# EAGLE design PALVersion (EAGLE 6.6.0)
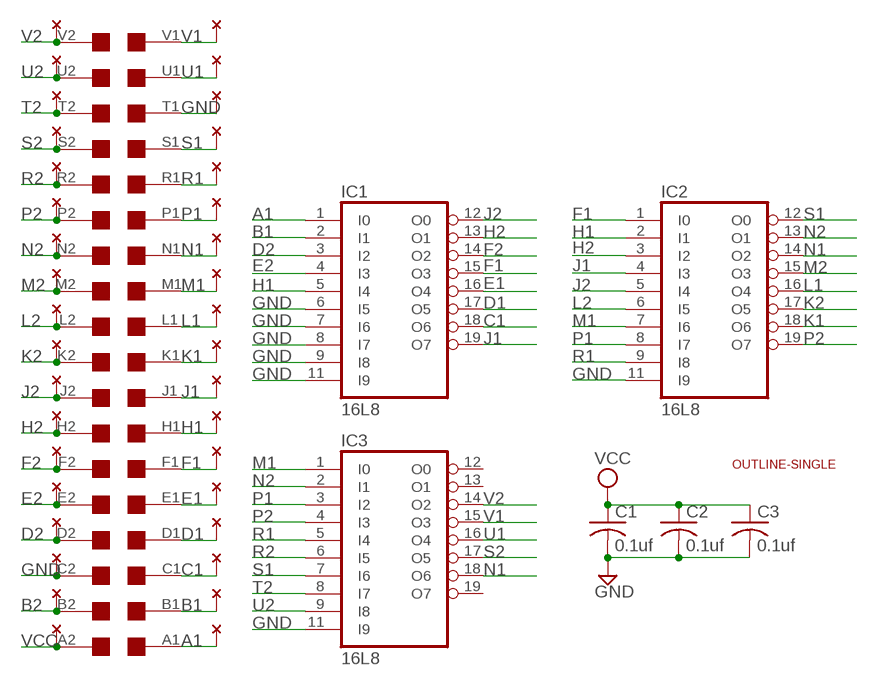
[diagram p0: schematic, sheet 1]

## Parts
C1  0.1uf  C-US050-025X075  [C050-025X075]
C2  0.1uf  C-US050-025X075  [C050-025X075]
C3  0.1uf  C-US050-025X075  [C050-025X075]
IC1  16L8  [DIL20]
IC2  16L8  [DIL20]
IC3  16L8  [DIL20]
U$1  EDGE-2CONNECTOR  [EDGE-CON2]
U$4  THRU-HOLE2A  [THRU-HOLEA]
U$5  OUTLINE-SINGLE  [SINGLE]

## Nets
A1: IC1.1(I0) U$1.A1 U$4.A1
B1: IC1.2(I1) U$1.B1 U$4.B1
B2: U$1.B2 U$4.B2
C1: IC1.18(O6) U$1.C1 U$4.C1
D1: IC1.17(O5) U$1.D1 U$4.D1
D2: IC1.3(I2) U$1.D2 U$4.D2
E1: IC1.16(O4) U$1.E1 U$4.E1
E2: IC1.4(I3) U$1.E2 U$4.E2
F1: IC1.15(O3) IC2.1(I0) U$1.F1 U$4.F1
F2: IC1.14(O2) U$1.F2 U$4.F2
GND: C1.2 C2.2 C3.2 IC1.6(I5) IC1.7(I6) IC1.8(I7) IC1.9(I8) IC1.11(I9) IC2.11(I9) IC3.11(I9) U$1.C2 U$1.T1 U$4.C2 U$4.T1
H1: IC1.5(I4) IC2.2(I1) U$1.H1 U$4.H1
H2: IC1.13(O1) IC2.3(I2) U$1.H2 U$4.H2
J1: IC1.19(O7) IC2.4(I3) U$1.J1 U$4.J1
J2: IC1.12(O0) IC2.5(I4) U$1.J2 U$4.J2
K1: IC2.18(O6) U$1.K1 U$4.K1
K2: IC2.17(O5) U$1.K2 U$4.K2
L1: IC2.16(O4) U$1.L1 U$4.L1
L2: IC2.6(I5) U$1.L2 U$4.L2
M1: IC2.7(I6) IC3.1(I0) U$1.M1 U$4.M1
M2: IC2.15(O3) U$1.M2 U$4.M2
N1: IC2.14(O2) IC3.18(O6) U$1.N1 U$4.N1
N2: IC2.13(O1) IC3.2(I1) U$1.N2 U$4.N2
P1: IC2.8(I7) IC3.3(I2) U$1.P1 U$4.P1
P2: IC2.19(O7) IC3.4(I3) U$1.P2 U$4.P2
R1: IC2.9(I8) IC3.5(I4) U$1.R1 U$4.R1
R2: IC3.6(I5) U$1.R2 U$4.R2
S1: IC2.12(O0) IC3.7(I6) U$1.S1 U$4.S1
S2: IC3.17(O5) U$1.S2 U$4.S2
T2: IC3.8(I7) U$1.T2 U$4.T2
U1: IC3.16(O4) U$1.U1 U$4.U1
U2: IC3.9(I8) U$1.U2 U$4.U2
V1: IC3.15(O3) U$1.V1 U$4.V1
V2: IC3.14(O2) U$1.V2 U$4.V2
VCC: C1.1 C2.1 C3.1 U$1.A2 U$4.A2
Unconnected: IC3.12(O0) IC3.13(O1) IC3.19(O7)

## Power pins joined to a net without a drawn wire
GND: IC1.10(GND) IC2.10(GND) IC3.10(GND)
VCC: IC1.20(VCC) IC2.20(VCC) IC3.20(VCC)

## Library data of the parts
C1-C3 = rcl:C-US: CAPACITOR, American symbol
IC1-IC3 = pal:16L8: PAL; MF: TEXAS INSTRUMENTS; MPN: TIBPAL16L8-7CN; OC_FARNELL: 1510033; OC_NEWARK: 08F8522
U$1 = dec-con:EDGE-2: Double-Sided DEC edge connector.
U$4 = dec-con:THRU-HOLE2: Thru-Hole addition to double-sided edge connector.
U$5 = dec-con:OUTLINE-*: Board outlines for DEC boards.

## Board
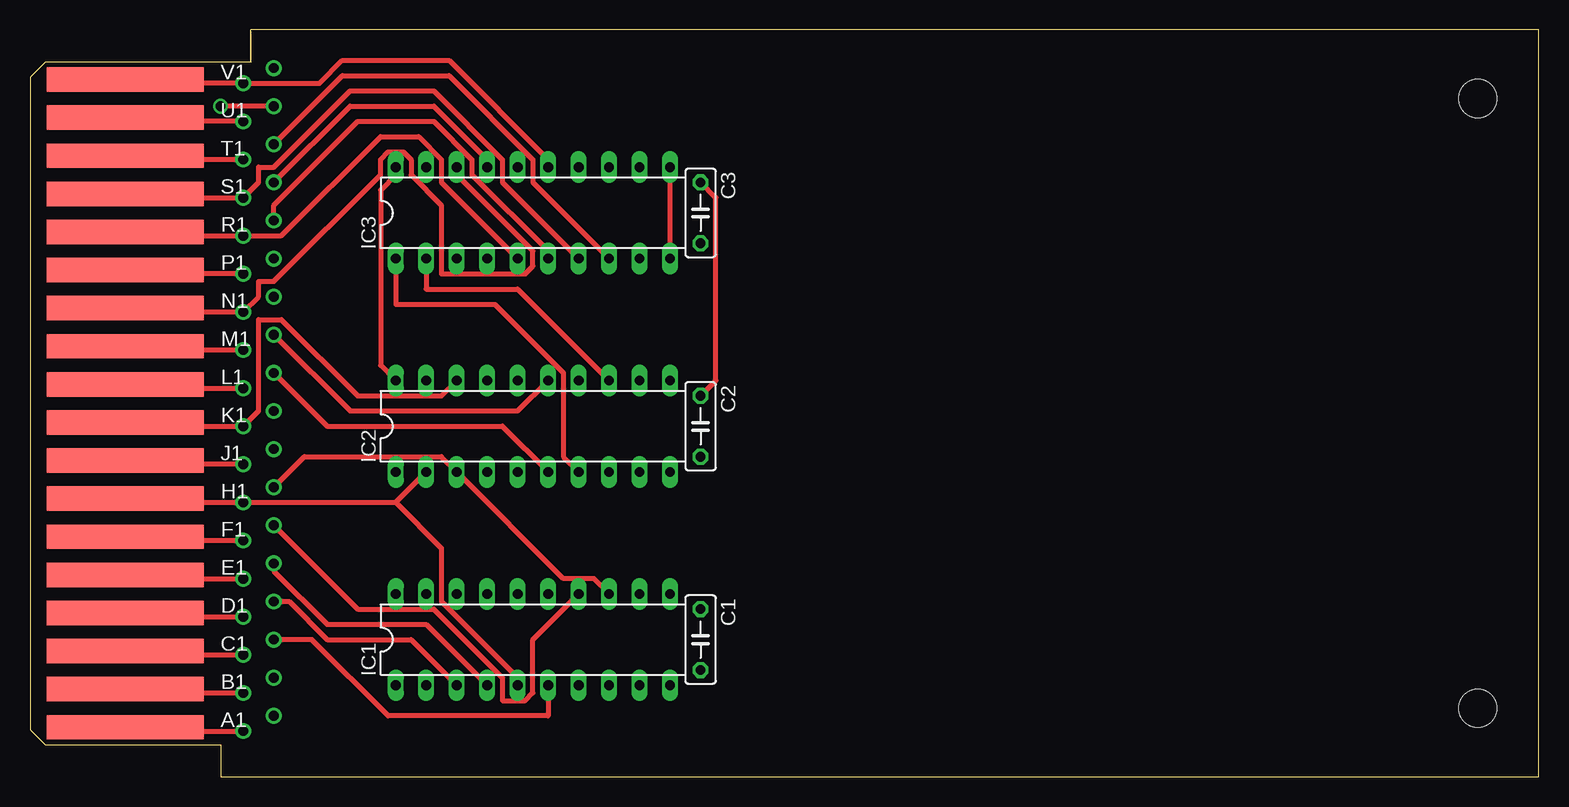
[diagram p1: board, top side]
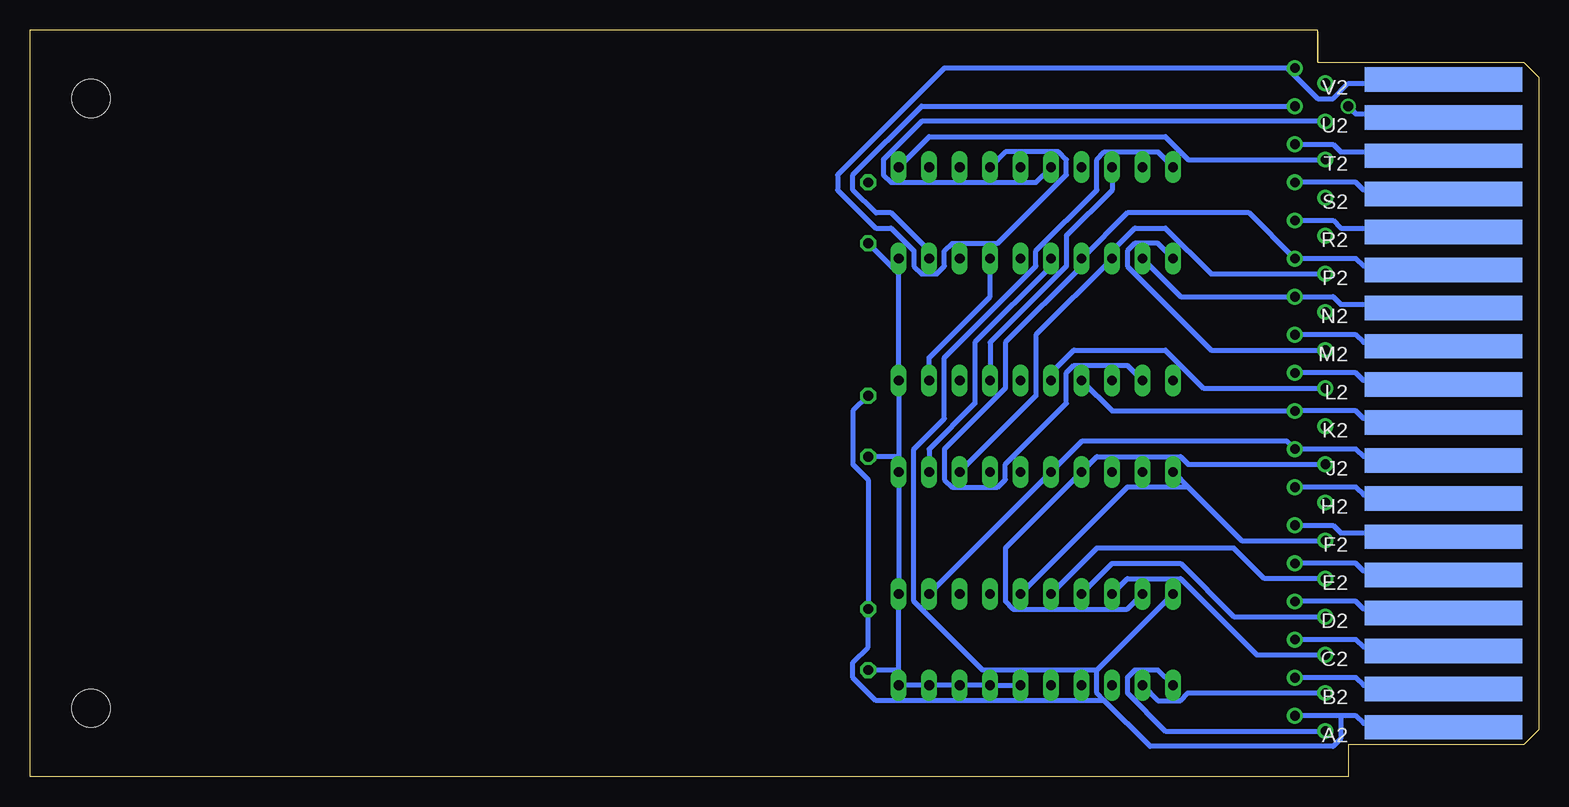
[diagram p2: board, bottom side, seen from below]

Size 125.73 x 62.23 mm. Coordinates in mm from the lower left corner, seen from the top.
Copper layers (1+16): Top 0.035mm / dielectric 1.5mm / Bottom 0.035mm
Design rules "16mils": minimum track width 16mil, minimum drill 32mil, track to track 15mil, track to pad 10mil, pad to pad 10mil, via to via 10mil, smd to smd 10mil, copper to edge 13mil, drill to drill 10mil, minimum pad ring 10mil, minimum via ring 8mil, stop-mask expansion 0mil, vias tented up to drill 0mil, thermal gap 10mil

### Footprints (pad centres in the part's own frame; a part is rotated, then mirrored left to right if it is on the bottom)
C050-025X075 = drill 0.813 octagon: 1 -2.54,0; 2 2.54,0
DIL20 = drill 0.813 long: 1 -11.43,-3.81; 2 -8.89,-3.81; 3 -6.35,-3.81; 4 -3.81,-3.81; 5 -1.27,-3.81; 6 1.27,-3.81; 7 3.81,-3.81; 8 6.35,-3.81; 9 8.89,-3.81; 10 11.43,-3.81; 11 11.43,3.81; 12 8.89,3.81; 13 6.35,3.81; 14 3.81,3.81; 15 1.27,3.81; 16 -1.27,3.81; 17 -3.81,3.81; 18 -6.35,3.81; 19 -8.89,3.81; 20 -11.43,3.81
EDGE-CON2 = smd 13.106 x 2.032: A1 7.938,4.128; B1 7.938,7.303; C1 7.938,10.477; D1 7.938,13.652; E1 7.938,16.828; F1 7.938,20.003; H1 7.938,23.177; J1 7.938,26.352; K1 7.938,29.527; L1 7.938,32.703; M1 7.938,35.877; N1 7.938,39.053; P1 7.938,42.227; R1 7.938,45.403; S1 7.938,48.578; T1 7.938,51.752; U1 7.938,54.928; V1 7.938,58.102 | smd 13.106 x 2.032 bottom: A2 7.938,4.128; B2 7.938,7.303; C2 7.938,10.477; D2 7.938,13.652; E2 7.938,16.828; F2 7.938,20.003; H2 7.938,23.177; J2 7.938,26.352; K2 7.938,29.527; L2 7.938,32.703; M2 7.938,35.877; N2 7.938,39.053; P2 7.938,42.227; R2 7.938,45.403; S2 7.938,48.578; T2 7.938,51.752; U2 7.938,54.928; V2 7.938,58.102
THRU-HOLEA = drill 0.813 pad 1.27: A1 17.78,3.81; A2 20.32,5.08; B1 17.78,6.985; B2 20.32,8.255; C1 17.78,10.16; C2 20.32,11.43; D1 17.78,13.335; D2 20.32,14.605; E1 17.78,16.51; E2 20.32,17.78; F1 17.78,19.685; F2 20.32,20.955; H1 17.78,22.86; H2 20.32,24.13; J1 17.78,26.035; J2 20.32,27.305; K1 17.78,29.21; K2 20.32,30.48; L1 17.78,32.385; L2 20.32,33.655; M1 17.78,35.56; M2 20.32,36.83; N1 17.78,38.735; N2 20.32,40.005; P1 17.78,41.91; P2 20.32,43.18; R1 17.78,45.085; R2 20.32,46.355; S1 17.78,48.26; S2 20.32,49.53; T1 17.78,51.435; T2 20.32,52.705; U1 17.78,54.61; U2 20.32,55.88; V1 17.78,57.785; V2 20.32,59.055
SINGLE = hole 3.175: 120.65,56.515; 120.65,5.715

### Placement (x,y rotation side)
C1  55.88,11.43 270 top
C2  55.88,29.21 270 top
C3  55.88,46.99 270 top
IC1  41.91,11.43 0 top
IC2  41.91,29.21 0 top
IC3  41.91,46.99 0 top
U$1  0,0 0 top
U$4  0,0 0 top
U$5  0,0 0 top

### Tracks (layer width: path | path; a pad name or v marks a point on that pad's centre or on a via)
A1
  Top 0.406: U$4.A1 8.26,3.81 U$1.A1
  Bottom 0.406: U$4.A1 31.12,3.81 34.29,6.99 34.29,8.26 33.66,8.89 31.75,8.89 IC1.1
B1
  Top 0.406: U$4.B1 8.26,6.99 U$1.B1
  Bottom 0.406: U$4.B1 29.21,6.99 29.85,6.35 31.75,6.35 IC1.2
B2
  Bottom 0.406: U$4.B2 15.24,8.26 14.61,7.62 8.26,7.62 U$1.B2
C1
  Top 0.406: U$4.C1 8.26,10.16 U$1.C1
  Bottom 0.406: U$4.C1 23.5,10.16 29.85,16.51 34.29,16.51 IC1.18
D1
  Top 0.406: U$4.D1 8.26,13.34 U$1.D1
  Bottom 0.406: U$4.D1 25.4,13.34 29.85,17.78 35.56,17.78 IC1.17
D2
  Top 0.406: IC1.3 31.75,11.43 24.77,11.43 21.59,14.61 U$4.D2
  Bottom 0.406: U$4.D2 15.24,14.61 14.61,13.97 8.26,13.97 U$1.D2
E1
  Top 0.406: U$4.E1 8.26,16.51 U$1.E1
  Bottom 0.406: IC1.16 36.83,19.05 25.4,19.05 22.86,16.51 U$4.E1
E2
  Top 0.406: IC1.4 33.02,12.7 24.77,12.7 20.32,17.14 U$4.E2
  Bottom 0.406: U$4.E2 15.24,17.78 14.61,17.14 8.26,17.14 U$1.E2
F1
  Top 0.406: U$4.F1 8.26,19.68 U$1.F1
  Bottom 0.406: U$4.F1 24.77,19.68 29.21,24.13 | IC2.1 29.21,24.13 | IC1.15 34.29,24.13 29.21,24.13
F2
  Top 0.406: IC1.14 41.91,11.43 41.91,6.99 41.28,6.35 39.37,6.35 39.37,8.26 33.66,13.97 27.31,13.97 U$4.F2
  Bottom 0.406: U$4.F2 17.15,20.95 16.51,20.32 8.26,20.32 U$1.F2
GND
  Top 0.406: U$4.T1 8.26,51.44 U$1.T1 | U$4.C2 23.5,11.43 29.85,5.08 43.18,5.08 IC1.6 | IC3.10 IC3.11
  Bottom 0.406: U$4.T1 29.21,51.44 31.12,53.34 50.8,53.34 IC3.11 | U$4.C2 15.24,11.43 14.61,10.79 8.26,10.79 U$1.C2 | IC1.6 IC1.7 IC1.8 IC1.9 IC1.10 53.34,8.89 | 53.34,8.89 IC1.11 IC2.10 53.34,26.67 | 53.34,8.89 C1.2 | 53.34,26.67 IC2.11 53.34,41.91 | 53.34,41.91 IC3.10 | 53.34,26.67 C2.2 | 53.34,41.91 C3.2
H1
  Top 0.406: U$1.H1 8.26,22.86 U$4.H1 30.48,22.86 | 30.48,22.86 IC2.2 | IC1.5 40.64,8.26 34.29,14.61 34.29,19.05 30.48,22.86
H2
  Top 0.406: IC1.13 46.99,16.51 44.45,16.51 IC2.3 34.29,26.67 22.86,26.67 U$4.H2
  Bottom 0.406: U$4.H2 15.24,24.13 14.61,23.5 8.26,23.5 U$1.H2
J1
  Top 0.406: U$4.J1 8.26,26.04 U$1.J1
  Bottom 0.406: IC1.19 34.29,13.97 43.82,13.97 44.45,14.61 44.45,19.05 IC2.4 36.83,26.67 29.85,26.67 29.21,26.04 U$4.J1
J2
  Bottom 0.406: IC1.12 IC2.5 38.1,27.94 20.96,27.94 U$4.J2 15.24,27.3 14.61,26.67 8.26,26.67 U$1.J2
K1
  Top 0.406: U$1.K1 8.26,29.21 U$4.K1 19.05,30.48 19.05,38.1 20.96,38.1 27.31,31.75 34.29,31.75 IC2.18
K2
  Bottom 0.406: IC2.17 35.56,30.48 U$4.K2 15.24,30.48 14.61,29.84 8.26,29.84 U$1.K2
L1
  Top 0.406: U$4.L1 8.26,32.38 U$1.L1
  Bottom 0.406: U$4.L1 27.94,32.38 31.12,35.56 38.74,35.56 40.64,33.66 IC2.16
L2
  Top 0.406: IC2.6 39.37,29.21 24.77,29.21 U$4.L2
  Bottom 0.406: U$4.L2 15.24,33.66 14.61,33.02 8.26,33.02 U$1.L2
M1
  Top 0.406: IC2.7 44.45,26.67 44.45,33.66 38.74,39.37 30.48,39.37 IC3.1 | U$4.M1 8.26,35.56 U$1.M1
  Bottom 0.406: U$4.M1 27.31,35.56 34.29,42.55 34.29,43.81 33.66,44.45 31.75,44.45 IC3.1
M2
  Top 0.406: IC2.15 40.64,30.48 26.67,30.48 U$4.M2
  Bottom 0.406: U$4.M2 15.24,36.83 14.61,36.2 8.26,36.2 U$1.M2
N1
  Top 0.406: U$1.N1 8.26,38.73 U$4.N1 19.05,40.01 19.05,41.27 20.32,41.27 29.21,50.16 29.21,51.44 29.85,52.07 31.12,52.07 31.75,51.44 31.75,50.16 34.29,47.62 34.29,41.91 41.28,41.91 41.91,42.55 41.91,43.81 35.56,50.16 IC3.18
  Bottom 0.406: IC2.14 45.72,36.2 39.37,42.55 39.37,45.09 35.56,48.9 IC3.18
N2
  Top 0.406: IC2.13 40.64,40.64 33.02,40.64 IC3.2
  Bottom 0.406: IC3.2 29.85,40.01 U$4.N2 17.15,40.01 16.51,39.37 8.26,39.37 U$1.N2
P1
  Top 0.406: U$4.P1 8.26,41.91 U$1.P1
  Bottom 0.406: U$4.P1 27.31,41.91 31.12,45.72 33.66,45.72 35.56,43.81 IC3.3 41.91,36.83 41.91,31.75 IC2.8
P2
  Bottom 0.406: IC2.19 34.29,34.29 38.74,34.29 39.37,33.66 39.37,31.11 44.45,26.04 44.45,24.77 45.09,24.13 48.9,24.13 49.53,24.77 49.53,27.3 44.45,32.38 44.45,36.2 38.1,42.55 IC3.4 34.29,46.99 24.13,46.99 U$4.P2 15.24,43.18 14.61,42.55 8.26,42.55 U$1.P2
R1
  Top 0.406: U$1.R1 8.26,45.09 U$4.R1 20.96,45.09 29.21,53.34 32.39,53.34 34.29,51.44 34.29,49.53 IC3.5
  Bottom 0.406: IC2.9 50.8,27.3 46.99,31.11 46.99,36.2 40.64,42.55 IC3.5
R2
  Top 0.406: IC3.6 43.18,43.81 36.83,50.16 36.83,51.44 33.66,54.61 27.31,54.61 20.32,47.62 U$4.R2
  Bottom 0.406: U$4.R2 17.15,46.35 16.51,45.72 8.26,45.72 U$1.R2
S1
  Top 0.406: U$1.S1 8.26,48.26 U$4.S1 19.05,49.53 19.05,50.8 20.32,50.8 26.67,57.15 33.66,57.15 39.37,51.44 39.37,49.53 IC3.7
  Bottom 0.406: IC3.7 45.72,40.01 50.8,34.92 IC2.12
S2
  Top 0.406: IC3.17 38.1,51.44 33.66,55.88 26.67,55.88 U$4.S2
  Bottom 0.406: U$4.S2 15.24,49.53 14.61,48.9 8.26,48.9 U$1.S2
T2
  Top 0.406: IC3.8 41.91,49.53 41.91,51.44 34.93,58.42 26.04,58.42 U$4.T2
  Bottom 0.406: U$4.T2 17.15,52.7 16.51,52.07 8.26,52.07 U$1.T2
U1
  Top 0.406: U$4.U1 8.26,54.61 U$1.U1
  Bottom 0.406: IC3.16 41.91,49.53 53.98,49.53 54.61,50.16 54.61,51.44 51.44,54.61 U$4.U1
U2  (via drill 0.81)
  Top 0.406: U$4.U2 v15.88,55.88
  Bottom 0.406: U$4.U2 51.44,55.88 57.15,50.16 57.15,48.9 55.25,46.99 53.98,46.99 50.8,43.81 IC3.9 | v15.88,55.88 15.24,55.24 8.26,55.24 U$1.U2
V1
  Top 0.406: IC3.15 43.18,51.44 34.93,59.69 26.04,59.69 24.13,57.78 U$4.V1 8.26,57.78 U$1.V1
V2
  Bottom 0.406: IC3.14 44.45,52.07 40.01,52.07 39.37,51.44 39.37,50.16 45.09,44.45 48.9,44.45 49.53,43.81 49.53,42.55 50.17,41.91 51.44,41.91 52.07,42.55 52.07,43.81 53.98,45.72 55.25,45.72 58.42,48.9 58.42,50.16 49.53,59.05 20.96,59.05 | 20.96,59.05 18.42,56.52 17.15,56.52 15.88,57.78 8.26,57.78 U$1.V2 | 20.96,59.05 U$4.V2
VCC
  Top 0.406: C3.1 57.15,48.26 57.15,33.02 C2.1 | IC2.20 29.21,34.29 29.21,48.9 30.48,50.16 IC3.20
  Bottom 0.406: C2.1 57.15,30.48 57.15,26.04 55.88,24.77 C1.1 55.88,10.79 57.15,9.53 57.15,8.26 55.25,6.35 36.2,6.35 | 16.51,5.08 15.24,5.08 14.61,4.45 8.26,4.45 U$1.A2 | 16.51,5.08 U$4.A2 | 36.83,8.89 IC1.20 | 36.83,8.89 36.83,6.99 36.2,6.35 | 36.2,6.35 32.39,2.54 17.15,2.54 16.51,3.17 16.51,5.08 | IC3.20 31.75,52.07 36.2,52.07 36.83,51.44 36.83,48.9 41.91,43.81 41.91,42.55 49.53,34.92 49.53,29.84 52.07,27.3 52.07,14.61 46.36,8.89 36.83,8.89